# Altium schematic sheet DM3370_Connector_A.SchDoc: =project_title
size Tabloid; CompanyName: Luxonis Holding; Organization: Luxonis Holding; Address1: 1925 Harmony Park Drive; Address2: Westminster, CO; Address3: 80234; Address4: United States; DocumentNumber: 4; SheetNumber: 4; SheetTotal: 17
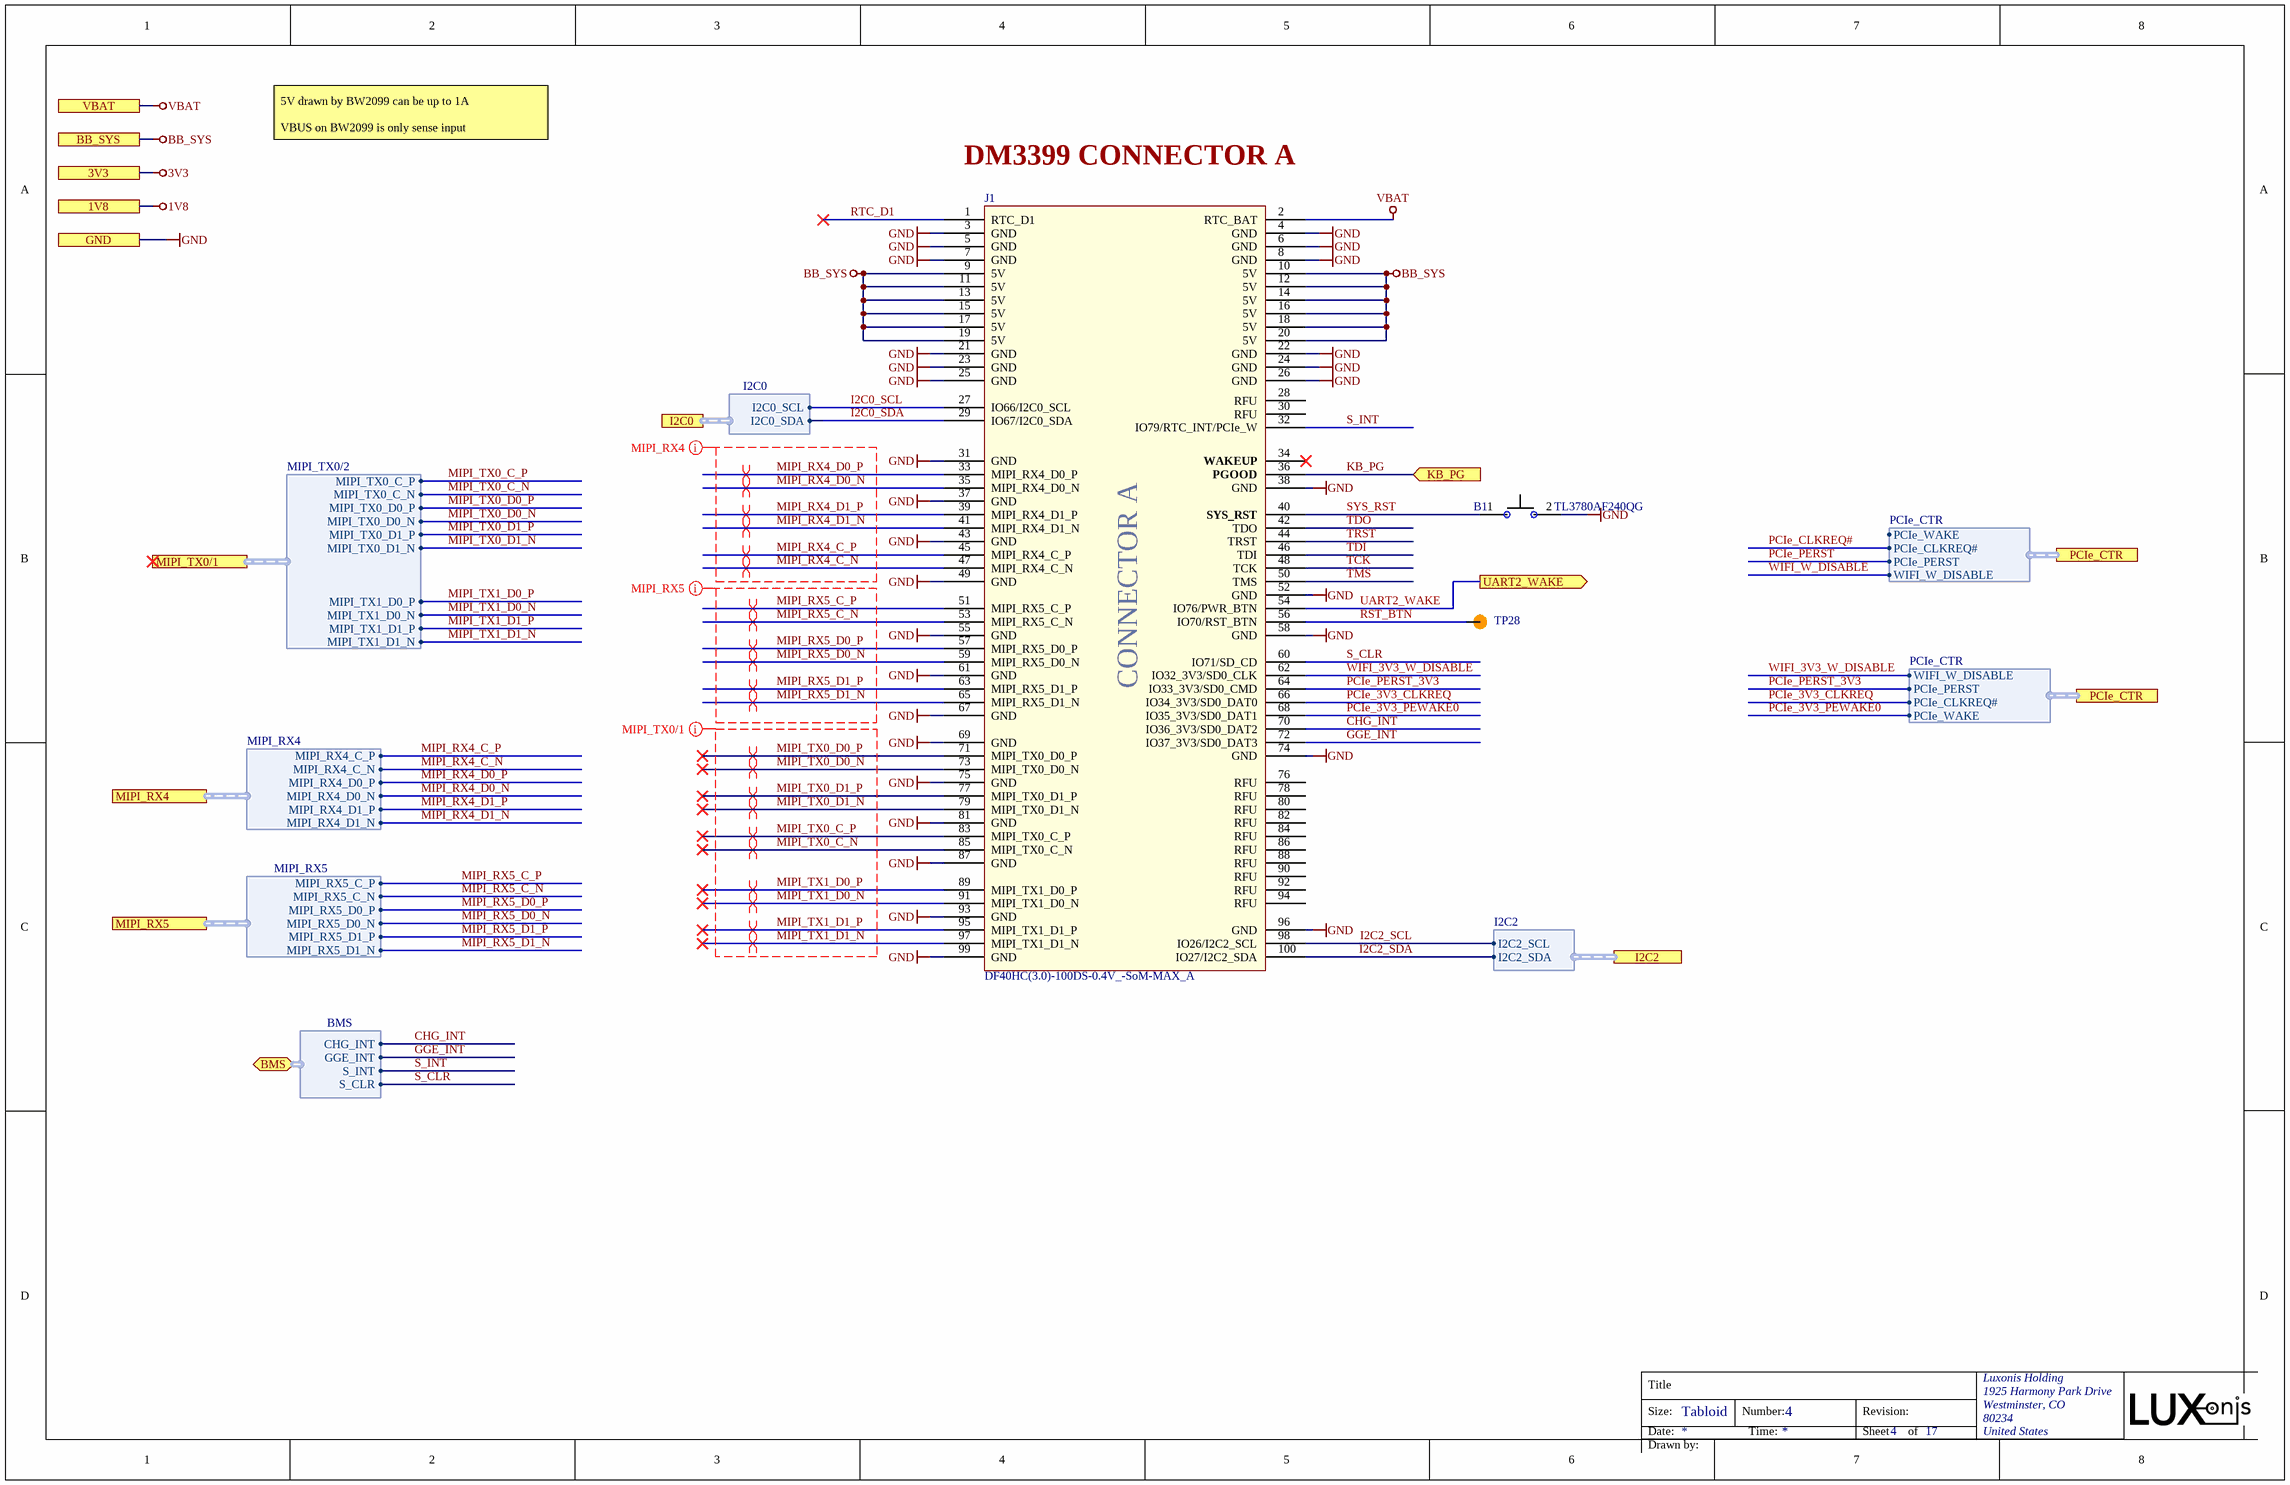
[diagram p0: DM3370_Connector_A.SchDoc]

## Parts
B1  TL3780AF240QG  [TL3780AF240QG-Footprint-1]
J1  DF40HC(3.0)-100DS-0.4V_-SoM-MAX_A  [SOM_MAX_CONN_A_DF40HC-3.0-100DS-0.4V_minpad]
TP28  TEST_POINT  [TP075_150_NS]  (value not drawn)  (no BOM)

## Ports
1V8, 3V3, BB_SYS, BMS (bidir, harness BMS), GND, I2C0 (harness I2C0), I2C2 (harness I2C2), KB_PG (in), MIPI_RX4 (harness MIPI_RX4), MIPI_RX5 (harness MIPI_RX5), MIPI_TX0/1 (harness MIPI_TX0/2), PCIe_CTR (harness PCIe_CTR), UART2_WAKE (out), VBAT

## Harnesses
I2C2: I2C2_SDA, I2C2_SCL
MIPI_RX4: MIPI_RX4_C_P, MIPI_RX4_C_N, MIPI_RX4_D0_P, MIPI_RX4_D0_N, MIPI_RX4_D1_P, MIPI_RX4_D1_N
MIPI_RX5: MIPI_RX5_C_P, MIPI_RX5_C_N, MIPI_RX5_D0_P, MIPI_RX5_D0_N, MIPI_RX5_D1_P, MIPI_RX5_D1_N
MIPI_TX0/2: MIPI_TX0_C_P, MIPI_TX0_C_N, MIPI_TX0_D0_P, MIPI_TX0_D0_N, MIPI_TX0_D1_P, MIPI_TX0_D1_N, MIPI_TX1_D0_P, MIPI_TX1_D0_N, MIPI_TX1_D1_P, MIPI_TX1_D1_N
I2C0: I2C0_SDA, I2C0_SCL
PCIe_CTR: PCIe_CLKREQ#, PCIe_PERST, PCIe_WAKE, WIFI_W_DISABLE
BMS: CHG_INT, GGE_INT, S_INT, S_CLR

## Nets
1V8: port 1V8
3V3: port 3V3
BB_SYS: J1.9(5V) J1.10(5V) J1.11(5V) J1.12(5V) J1.13(5V) J1.14(5V) J1.15(5V) J1.16(5V) J1.17(5V) J1.18(5V) J1.19(5V) J1.20(5V) ; port BB_SYS
GND: B1.2 J1.3(GND) J1.4(GND) J1.5(GND) J1.6(GND) J1.7(GND) J1.8(GND) J1.21(GND) J1.22(GND) J1.23(GND) J1.24(GND) J1.25(GND) J1.26(GND) J1.31(GND) J1.37(GND) J1.38(GND) J1.43(GND) J1.49(GND) J1.52(GND) J1.55(GND) J1.58(GND) J1.61(GND) J1.67(GND) J1.69(GND) J1.74(GND) J1.75(GND) J1.81(GND) J1.87(GND) J1.93(GND) J1.96(GND) J1.99(GND) ; port GND
VBAT: J1.2(RTC_BAT) ; port VBAT
CHG_INT: J1.70(IO36_3V3/SD0_DAT2) ; port BMS.CHG_INT
GGE_INT: J1.72(IO37_3V3/SD0_DAT3) ; port BMS.GGE_INT
I2C0_SCL: J1.27(IO66/I2C0_SCL) ; port I2C0.I2C0_SCL
I2C0_SDA: J1.29(IO67/I2C0_SDA) ; port I2C0.I2C0_SDA
I2C2_SCL: J1.98(IO26/I2C2_SCL) ; port I2C2.I2C2_SCL
I2C2_SDA: J1.100(IO27/I2C2_SDA) ; port I2C2.I2C2_SDA
KB_PG: J1.36(PGOOD) ; port KB_PG
MIPI_RX4_C_N: J1.47(MIPI_RX4_C_N) ; port MIPI_RX4.MIPI_RX4_C_N
MIPI_RX4_C_P: J1.45(MIPI_RX4_C_P) ; port MIPI_RX4.MIPI_RX4_C_P
MIPI_RX4_D0_N: J1.35(MIPI_RX4_D0_N) ; port MIPI_RX4.MIPI_RX4_D0_N
MIPI_RX4_D0_P: J1.33(MIPI_RX4_D0_P) ; port MIPI_RX4.MIPI_RX4_D0_P
MIPI_RX4_D1_N: J1.41(MIPI_RX4_D1_N) ; port MIPI_RX4.MIPI_RX4_D1_N
MIPI_RX4_D1_P: J1.39(MIPI_RX4_D1_P) ; port MIPI_RX4.MIPI_RX4_D1_P
MIPI_RX5_C_N: J1.53(MIPI_RX5_C_N) ; port MIPI_RX5.MIPI_RX5_C_N
MIPI_RX5_C_P: J1.51(MIPI_RX5_C_P) ; port MIPI_RX5.MIPI_RX5_C_P
MIPI_RX5_D0_N: J1.59(MIPI_RX5_D0_N) ; port MIPI_RX5.MIPI_RX5_D0_N
MIPI_RX5_D0_P: J1.57(MIPI_RX5_D0_P) ; port MIPI_RX5.MIPI_RX5_D0_P
MIPI_RX5_D1_N: J1.65(MIPI_RX5_D1_N) ; port MIPI_RX5.MIPI_RX5_D1_N
MIPI_RX5_D1_P: J1.63(MIPI_RX5_D1_P) ; port MIPI_RX5.MIPI_RX5_D1_P
MIPI_TX0_C_N: J1.85(MIPI_TX0_C_N) ; port MIPI_TX0/1.MIPI_TX0_C_N
MIPI_TX0_C_P: J1.83(MIPI_TX0_C_P) ; port MIPI_TX0/1.MIPI_TX0_C_P
MIPI_TX0_D0_N: J1.73(MIPI_TX0_D0_N) ; port MIPI_TX0/1.MIPI_TX0_D0_N
MIPI_TX0_D0_P: J1.71(MIPI_TX0_D0_P) ; port MIPI_TX0/1.MIPI_TX0_D0_P
MIPI_TX0_D1_N: J1.79(MIPI_TX0_D1_N) ; port MIPI_TX0/1.MIPI_TX0_D1_N
MIPI_TX0_D1_P: J1.77(MIPI_TX0_D1_P) ; port MIPI_TX0/1.MIPI_TX0_D1_P
MIPI_TX1_D0_N: J1.91(MIPI_TX1_D0_N) ; port MIPI_TX0/1.MIPI_TX1_D0_N
MIPI_TX1_D0_P: J1.89(MIPI_TX1_D0_P) ; port MIPI_TX0/1.MIPI_TX1_D0_P
MIPI_TX1_D1_N: J1.97(MIPI_TX1_D1_N) ; port MIPI_TX0/1.MIPI_TX1_D1_N
MIPI_TX1_D1_P: J1.95(MIPI_TX1_D1_P) ; port MIPI_TX0/1.MIPI_TX1_D1_P
PCIe_3V3_CLKREQ: J1.66(IO34_3V3/SD0_DAT0) ; port PCIe_CTR.PCIe_CLKREQ#  [also labelled PCIe_CLKREQ#]
PCIe_3V3_PEWAKE0: J1.68(IO35_3V3/SD0_DAT1) ; port PCIe_CTR.PCIe_WAKE
PCIe_PERST: J1.64(IO33_3V3/SD0_CMD) ; port PCIe_CTR.PCIe_PERST  [also labelled PCIe_PERST_3V3]
RST_BTN: J1.56(IO70/RST_BTN) TP28.1
RTC_D1: J1.1(RTC_D1)
S_CLR: J1.60(IO71/SD_CD) ; port BMS.S_CLR
S_INT: J1.32(IO79/RTC_INT/PCIe_W) ; port BMS.S_INT
SYS_RST: B1.1 J1.40(SYS_RST)
TCK: J1.48(TCK)
TDI: J1.46(TDI)
TDO: J1.42(TDO)
TMS: J1.50(TMS)
TRST: J1.44(TRST)
UART2_WAKE: J1.54(IO76/PWR_BTN) ; port UART2_WAKE
WIFI_3V3_W_DISABLE: J1.62(IO32_3V3/SD0_CLK) ; port PCIe_CTR.WIFI_W_DISABLE  [also labelled WIFI_W_DISABLE]

Not connected (* = marked no-connect by the designer): J1 28(RFU) 30(RFU) 34(WAKEUP)* 76(RFU) 78(RFU) 80(RFU) 82(RFU) 84(RFU) 86(RFU) 88(RFU) 90(RFU) 92(RFU) 94(RFU)

## Layout directives
differential pair; differential pair class 100ohm: MIPI_RX4_C_N, MIPI_RX4_C_P, MIPI_RX4_D0_N, MIPI_RX4_D0_P, MIPI_RX4_D1_N, MIPI_RX4_D1_P, MIPI_RX5_C_N, MIPI_RX5_C_P, MIPI_RX5_D0_N, MIPI_RX5_D0_P, MIPI_RX5_D1_N, MIPI_RX5_D1_P, MIPI_TX0_C_N, MIPI_TX0_C_P, MIPI_TX0_D0_N, MIPI_TX0_D0_P, MIPI_TX0_D1_N, MIPI_TX0_D1_P, MIPI_TX1_D0_N, MIPI_TX1_D0_P, MIPI_TX1_D1_N, MIPI_TX1_D1_P
net class MIPI_RX4: MIPI_RX4_C_N, MIPI_RX4_C_P, MIPI_RX4_D0_N, MIPI_RX4_D0_P, MIPI_RX4_D1_N, MIPI_RX4_D1_P
net class MIPI_TX0/1: MIPI_TX0_C_N, MIPI_TX0_C_P, MIPI_TX0_D0_N, MIPI_TX0_D0_P, MIPI_TX0_D1_N, MIPI_TX0_D1_P, MIPI_TX1_D0_N, MIPI_TX1_D0_P, MIPI_TX1_D1_N, MIPI_TX1_D1_P
net class MIPI_RX5: MIPI_RX5_C_N, MIPI_RX5_C_P, MIPI_RX5_D0_N, MIPI_RX5_D0_P, MIPI_RX5_D1_N, MIPI_RX5_D1_P

## Notes on the sheet
- 5V drawn by BW2099 can be up to 1A
  VBUS on BW2099 is only sense input
- (near J1) DM3399 CONNECTOR A
- Title
- Size:
- Date:
- Tabloid
- Number:
- Time:
- Revision:
- Sheet
- of
- Drawn by:
- (in symbol CMP-040-000000-5) CONNECTOR A

## Library data of the parts
B1 = CMP-011-00023-1: Keypad Switch, 1 Switches, SPST, Momentary-tactile, 0.05A, 12VDC, 2.35N, Solder Terminal, Surface Mount-straight; Manufacturer 1: E-Switch; Manufacturer Part Number 1: TL3780AF240QG
J1 = CMP-040-000000-5: OAK-SoM-MAX base board conn. A; Manufacturer 1: Hirose; Manufacturer Part Number 1: DF40HC(3.0)-100DS-0.4V(58); Pitch: 0.016inch; System: Connector; Connector Type: Receptacle; Number of Positions: 100; Lead Free: Lead Free; Design Item ID: DF40HC(3.0)-100DS-0.4V_-SoM-MAX_A; Source: LuxonisMaster_nejc.SchLib; Pricing 2: 1=2.50000, 10=2.40000, 25=2.10000, 50=2.10000, 100=2.00000, 250=1.76000, 500=1.71000, 1000=1.45000, 2000=1.36000, 5000=1.31000, 10000=1.31000 (USD); RoHS: Yes; Mount: Surface Mount; ComponentLink1Description: https://datasheet.ciiva.com/46636/ed-df40-20140305-46636517.pdf?src-supplier=Digi-Key; Contact Plating: Gold; ComponentLink1URL: https://datasheet.ciiva.com/46636/ed-df40-20140305-46636517.pdf?src-supplier=Digi-Key; ComponentLink4Description: https://datasheet.ciiva.com/18562/ed-df40-20140305-18562462.pdf?src-supplier=Digi-Key; Stock 2: 2078; ComponentLink4URL: https://datasheet.ciiva.com/18562/ed-df40-20140305-18562462.pdf?src-supplier=Digi-Key; Packaging: Tape and Reel; Package Quantity: 1000; ComponentLink3Description: https://datasheet.ciiva.com/13559/ed-df40-20140305-13559540.pdf?src-supplier=Mouser; Pricing 1: 1=2.54000, 10=2.26000, 25=2.07000, 50=2.07000, 100=1.98000, 250=1.79000, 500=1.65000, 1000=1.41000, 3000=1.32000, 6000=1.23000, 10000=1.23000 (USD); Stock 1: 2172; ComponentLink2Description: https://datasheet.ciiva.com/18562/ed-df40-20140305-18562189.pdf?src-supplier=Digi-Key; Number of Rows: 2; ComponentLink3URL: https://datasheet.ciiva.com/13559/ed-df40-20140305-13559540.pdf?src-supplier=Mouser; ComponentLink2URL: https://datasheet.ciiva.com/18562/ed-df40-20140305-18562189.pdf?src-supplier=Digi-Key
TP28 = CMP-015-000000-1: Design Item ID: TEST_POINT; Source: LuxonisMaster.SchLib